# Altium project H_Bridge_Rev0.2.PrjPcb
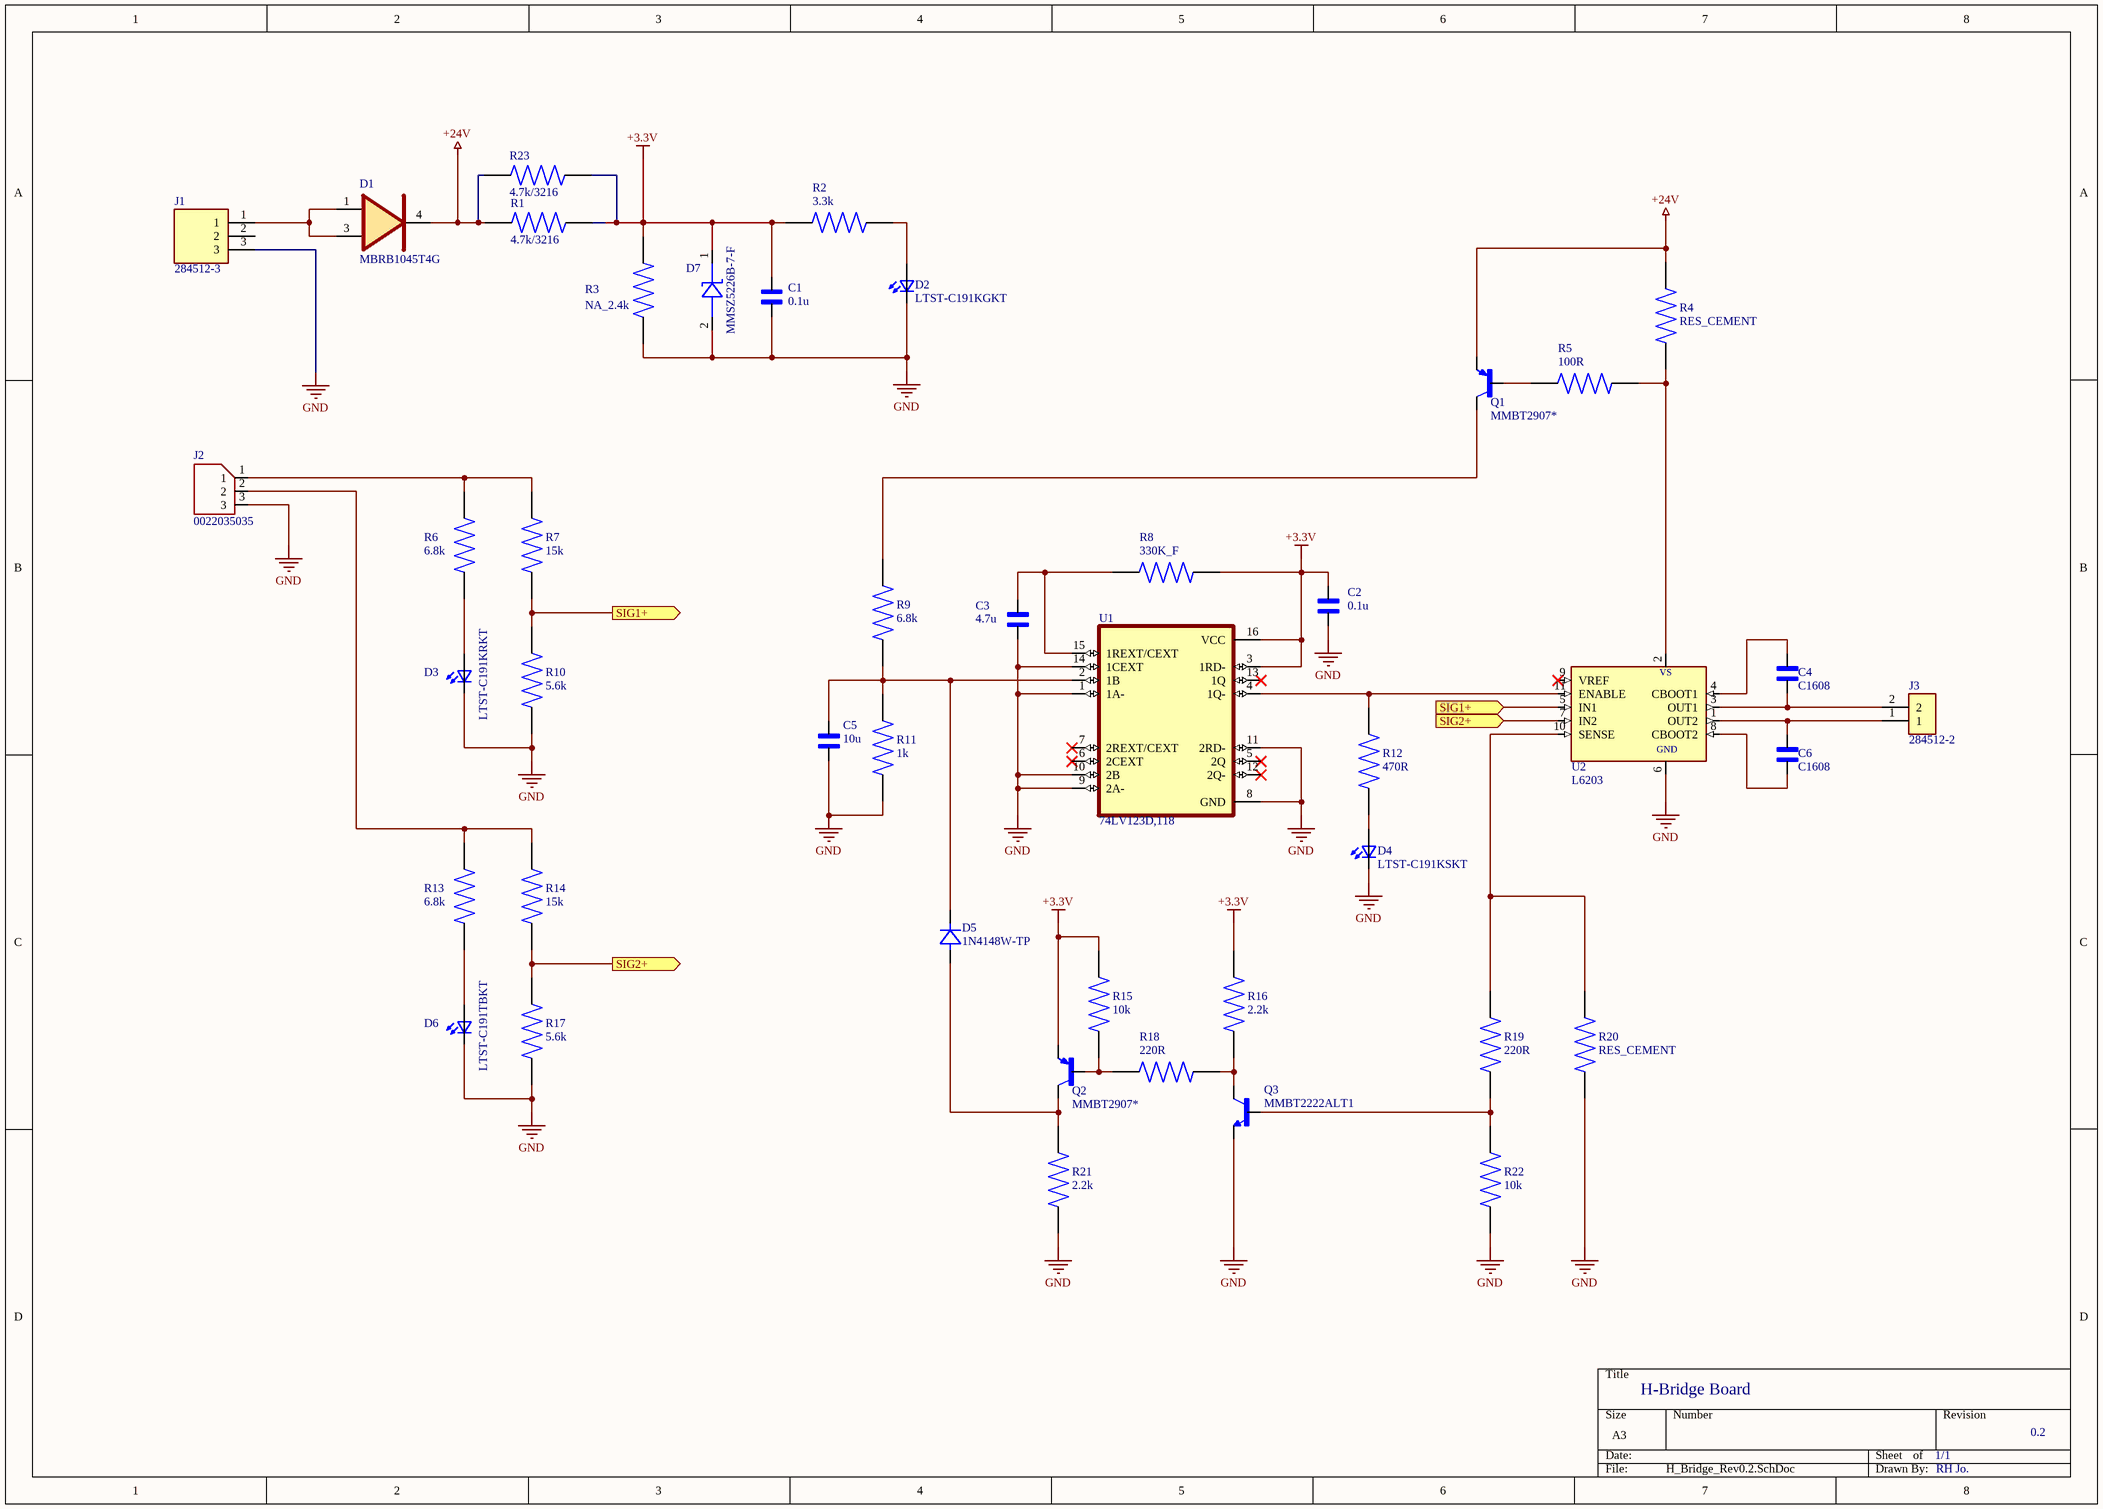
[diagram p0: H_Bridge_Rev0.2.SchDoc]
1 sheet, 44 parts. Net scope: flat (ports and power ports of the same name join across sheets).
Board file: H_Bridge_Rev0.2.PcbDoc

## Sheet H_Bridge_Rev0.2.SchDoc: H-Bridge Rev0.2
size A3; Date: 2021.10.26; CompanyName: ATIK; DrawnBy: RH Jo; Revision: 0.2; SheetNumber: 1; SheetTotal: 1

### Parts
C1  0.1u  [C1608]
C2  0.1u  [C1608]
C3  4.7u  [C1608]
C4  C1608  [C1608]
C5  10u  [C1608]
C6  C1608  [C1608]
D1  MBRB1045T4G  [TO254P1524X483-3]
D2  LTST-C191KGKT  [0603]
D3  LTST-C191KRKT  [0603]
D4  LTST-C191KSKT  [0603]
D5  1N4148W-TP  [SOD123]
D6  LTST-C191TBKT  [0603]
D7  MMSZ5226B-7-F  [SOD3715X135L32X57N]
J1  284512-3  [TE_284512-3]
J2  0022035035  [MOLEX22035035]
J3  284512-2  [TE_284512-2]
Q1  MMBT2907*  [SOT23-BEC]
Q2  MMBT2907*  [SOT23-BEC]
Q3  MMBT2222ALT1  [SOT95P237X111-3N]
R1  4.7k/3216  [R3216]
R2  3.3k  [R1608]
R3  NA_2.4k  [R1608]
R4  RES_CEMENT  [RES_CEMENT]
R5  100R  [R1608]
R6  6.8k  [R1608]
R7  15k  [R1608]
R8  330K_F  [R1608]
R9  6.8k  [R1608]
R10  5.6k  [R1608]
R11  1k  [R1608]
R12  470R  [R1608]
R13  6.8k  [R1608]
R14  15k  [R1608]
R15  10k  [R1608]
R16  2.2k  [R1608]
R17  5.6k  [R1608]
R18  220R  [R1608]
R19  220R  [R1608]
R20  RES_CEMENT  [RES_CEMENT]
R21  2.2k  [R1608]
R22  10k  [R1608]
R23  4.7k/3216  [R3216]
U1  74LV123D,118  [SOIC127P600X175-16N]
U2  L6203  [MULTIWATT-11]

### Ports
SIG1+ (in), SIG1+ (out), SIG2+ (in), SIG2+ (out)

### Nets
+3.3V: C1.2 C2.2 D7.1(C) Q2.E R1.2 R2.1 R3.2 R8.2 R15.2 R16.2 R23.2 U1.3(1RD-) U1.16(VCC)
+24V: D1.4(OUT) Q1.E R1.1 R4.2 R23.1
GND: C1.1 C2.1 C3.1 C5.1 D2.1(K2) D3.1(K2) D4.1(K2) D6.1(K2) D7.2(A) J1.3 J2.3 Q3.2(E) R3.1 R10.1 R11.1 R17.1 R20.1 R21.1 R22.1 U1.1(1A-) U1.8(GND) U1.9(2A-) U1.10(2B) U1.11(2RD-) U1.14(1CEXT) U2.6(GND)
NetC3_2: C3.2 R8.1 U1.15(1REXT/CEXT)
NetC4_1: C4.1 J3.2 U2.3(OUT1)
NetC4_2: C4.2 U2.4(CBOOT1)
NetC5_2: C5.2 D5.1 R9.1 R11.2 U1.2(1B)
NetC6_1: C6.1 U2.8(CBOOT2)
NetC6_2: C6.2 J3.1 U2.1(OUT2)
NetD1_1: D1.1(IN-1) D1.3(IN) J1.1
NetD2_2: D2.2(A2) R2.2
NetD3_2: D3.2(A2) R6.1
NetD4_2: D4.2(A2) R12.1
NetD5_2: D5.2 Q2.C R21.2
NetD6_2: D6.2(A2) R13.1
NetJ2_1: J2.1 R6.2 R7.2
NetJ2_2: J2.2 R13.2 R14.2
NetQ1_B: Q1.B R5.1
NetQ1_C: Q1.C R9.2
NetQ2_B: Q2.B R15.1 R18.1
NetQ3_1: Q3.1(B) R19.1 R22.2
NetQ3_3: Q3.3(C) R16.1 R18.2
NetR4_1: R4.1 R5.2 U2.2(VS)
NetR7_1: R7.1 R10.2 U2.5(IN1) ; port SIG1+
NetR12_2: R12.2 U1.4(1Q-) U2.11(ENABLE)
NetR14_1: R14.1 R17.2 U2.7(IN2) ; port SIG2+
NetR19_2: R19.2 R20.2 U2.10(SENSE)

Not connected (* = marked no-connect by the designer): J1 2; U1 5(2Q)* 6(2CEXT)* 7(2REXT/CEXT)* 12(2Q-)* 13(1Q)*; U2 9(VREF)*

### Notes on the sheet
- H-Bridge Board
- 1/1
- 0.2
- RH Jo.

### Library data of the parts
C1-C6 = C1608: CAP1608; Package: None; Price: None; Value: *; Availability: Unavailable
D1 = MBRB1045T4G: Diode Schottky 45 V 10A Surface Mount DÂ²PAK; MF: ON Semiconductor; Price: None; Value: *; Check_prices: https://www.snapeda.com/parts/MBRB1045T4G/Onsemi/view-part/312743/?ref=eda; Package: D2PAK-3 ON Semiconductor; SnapEDA_Link: https://www.snapeda.com/parts/MBRB1045T4G/Onsemi/view-part/312743/?ref=snap; Purchase-URL: https://pricing.snapeda.com/search/part/MBRB1045T4G/?ref=eda; Availability: In Stock; MP: MBRB1045T4G
D2-D4 D6 = LTST-C191KRKT: Red 631nm LED Indication - Discrete 2V 0603 _1608 Metric_; MF: Lite-On Inc.; Value: *; Package: 0603 Lite-On; Digi-Key_Purchase_URL: https://www.digikey.in/product-detail/en/lite-on-inc/LTST-C191KRKT/160-1447-1-ND/386836?utm_source=snapeda&utm_medium=aggregator&utm_campaign=symbol; SnapEDA_Link: https://www.snapeda.com/parts/LTST-C191KRKT/Lite-On%20Inc./view-part/234319/?ref=snap; Digi-Key_Part_Number: 160-1447-1-ND; MP: LTST-C191KRKT
D5 = 1N4148W-TP: Diode Standard 100V 150mA Surface Mount SOD-123; MF: Micro Commercial; Value: *; Package: SOD-123 Microsemi; MP: 1N4148W-TP; Price: None; Availability: Unavailable; SnapEDA_Link: https://www.snapeda.com/parts/1N4148W-TP/Micro%20Commercial/view-part/232376/?ref=snap
D7 = MMSZ5226B-7-F: Zener Diode 3.3V 500mW Â±5% Surface Mount SOD-123; MF: Diodes Inc.; Value: *; MP: MMSZ5226B-7-F; Package: SOD-123 Diodes Inc.; Availability: Unavailable; SnapEDA_Link: https://www.snapeda.com/parts/MMSZ5226B-7-F/Diodes%20Inc./view-part/829072/?ref=snap; Price: None
J1 = 284512-3: Pluggable terminal block; socket; male; angled; 3.5mm;; MF: TE Connectivity; Centerline_Pitch: 3.5 mm[.138 in]; Number_of_Positions: 3; SnapEDA_Link: https://www.snapeda.com/parts/284512-3/TE%20Connectivity%20AMP%20Connectors/view-part/223060/?ref=snap; MP: 284512-3; Price: None; EU_RoHS_Compliance: Compliant; Availability: Unavailable; TE_purchase_URL: https://www.te.com/usa-en/product-284512-3.html?te_bu=Cor&te_type=disp&te_campaign=seda_glo_cor-seda-global-disp-prtnr-fy19-seda-model-bom-cta_sma-317_1&elqCampaignId=32493; Value: *; Package: None
J2 = 0022035045: Connector Header Through Hole 4 position 0.098 _2.50mm_; MF: Molex, LLC; Price: None; Availability: Unavailable; MP: 0022035045; Package: None; SnapEDA_Link: https://www.snapeda.com/parts/0022035045/Molex/view-part/3119547/?ref=snap; Value: *
J3 = 284512-2: Terminal Block Header, 2, 300 V, 11 A, 3.5 mm, Through Hole Right Angle, Header; MF: TE Connectivity; SnapEDA_Link: https://www.snapeda.com/parts/284512-2/TE%20Connectivity%20AMP%20Connectors/view-part/2581711/?ref=snap; MP: 284512-2; Price: None; Value: *; Availability: Unavailable; TE_purchase_URL: https://www.te.com/usa-en/product-284512-2.html?te_bu=Cor&te_type=disp&te_campaign=seda_glo_cor-seda-global-disp-prtnr-fy19-seda-model-bom-cta_sma-317_1&elqCampaignId=32493; Package: None
Q1 Q2 = MMBT2907*: Bipolar _BJT_ Transistor PNP 60V 600mA 200MHz 300mW Surface Mount SOT-23-3; MF: ON Semiconductor; Digi-Key_Part_Number: MMBT2907A-FDICT-ND; Digi-Key_Purchase_URL: https://www.digikey.ru/product-detail/en/diodes-incorporated/MMBT2907A-7-F/MMBT2907A-FDICT-ND/815725?utm_source=snapeda&utm_medium=aggregator&utm_campaign=symbol; SnapEDA_Link: https://www.snapeda.com/parts/MMBT2907/ON%20Semiconductor/view-part/2290516/?ref=snap; Package: SOT-23 ON Semiconductor; MP: MMBT2907; Value: *
Q3 = MMBT2222ALT1: Bipolar (BJT) Transistor NPN 40V 600mA 300MHz 225mW Surface Mount SOT-23; MF: ON Semiconductor; SnapEDA_Link: https://www.snapeda.com/parts/MMBT2222ALT1/ON%20Semiconductor/view-part/2888608/?ref=snap; Value: *; Availability: Unavailable; MP: MMBT2222ALT1; Price: None; Package: SOT-23 Motorola
R1 R23 = R3216: Res 3216; Resistance: 10; Tolerance: 5%; MP: FCR1206J10R; Power_Rating: .125 W; MF: TE Connectivity; DigiKey-Purchase-URL: https://snapeda.com/shop?store=DigiKey&id=988597; Package: 1206; EU_RoHS_Compliance: Compliant with Exemptions; Value: *; Price: None; SnapEDA_Link: https://www.snapeda.com/parts/FCR1206J10R/TE%20Connectivity%20Passive%20Product/view-part/988597/?ref=snap; Mouser-Purchase-URL: https://snapeda.com/shop?store=Mouser&id=988597; Availability: Warning
R2 R3 R5-R19 R21 R22 = R1608: Package: None; Price: None; Value: *; Availability: Unavailable
U1 = 74LV123D,118: Monostable Multivibrator Dual-Element -40Â°C 125Â°C Automotive 16-Pin SO T/R; MF: Nexperia; Price: None; Value: *; Check_prices: https://www.snapeda.com/parts/74LV123D,118/Nexperia/view-part/5057557/?ref=eda; Package: SO-16 Nexperia USA Inc.; SnapEDA_Link: https://www.snapeda.com/parts/74LV123D,118/Nexperia/view-part/5057557/?ref=snap; Purchase-URL: https://pricing.snapeda.com/search/part/74LV123D,118/?ref=eda; Availability: In Stock; MP: 74LV123D,118
U2 = L6203: Half Bridge _2_ Driver DC Motors, General Purpose BCDMOS 11-Multiwatt; MF: STMicroelectronics; Availability: Unavailable; MP: L6203; Value: *; SnapEDA_Link: https://www.snapeda.com/parts/L6203/STMicroelectronics/view-part/5573/?ref=snap; Price: None; Package: Multiwatt-11 STMicroelectronics